# EAGLE schematic LCD (EAGLE 9.0.0)
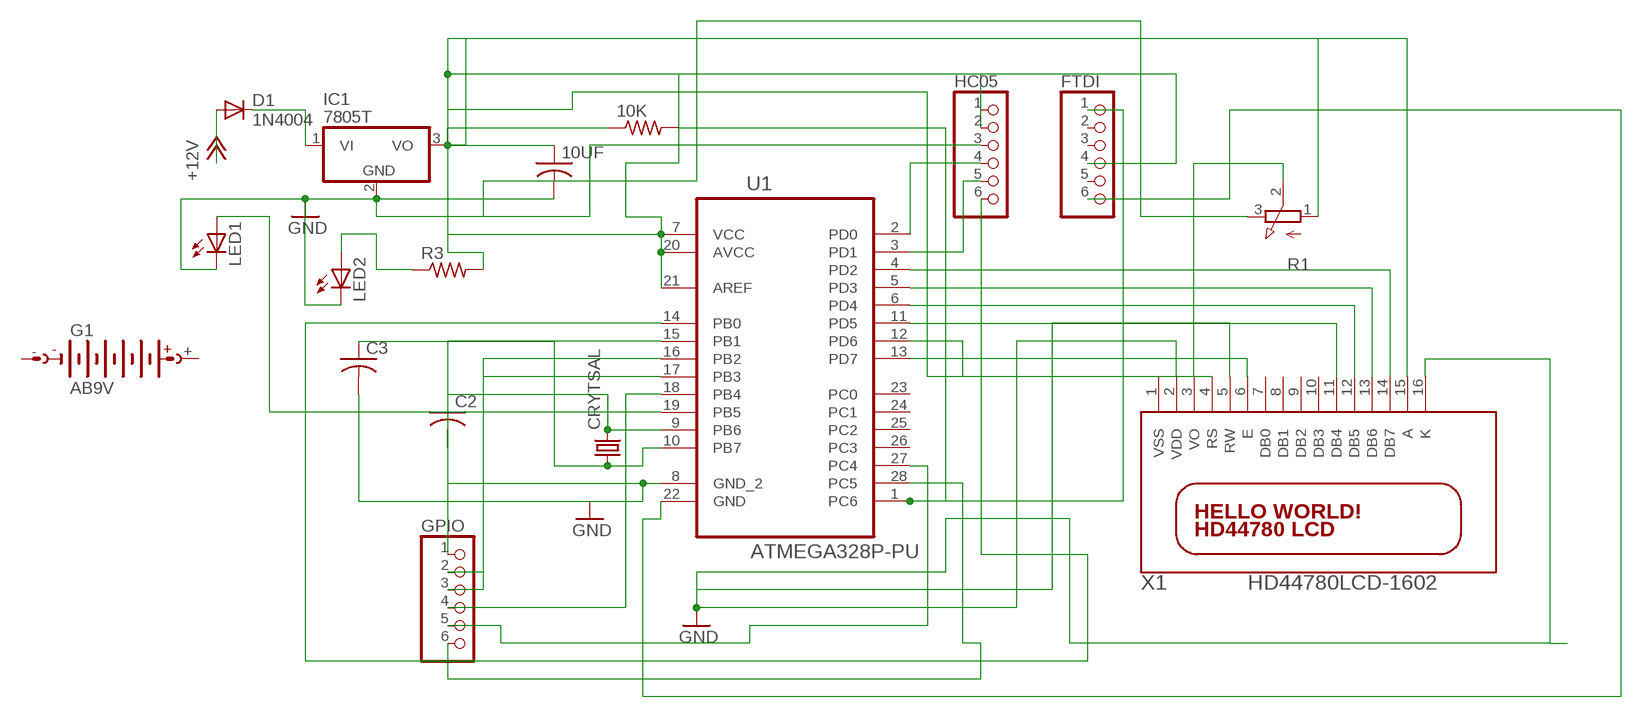
[diagram p0: schematic, sheet 1]

## Parts
10K  R-US_0204/5  [0204/5]
10UF  C-US050-025X075  [C050-025X075]
C2  C-US025-024X044  [C025-024X044]
C3  C-US025-024X044  [C025-024X044]
CRYTSAL  CRYSTALHC49U-V  [HC49U-V]
D1  1N4004  [DO41-10]
FTDI  PINHD-1X6-3.5MM  [1X06-3.5MM]
G1  AB9V  [AB9V]
GPIO  PINHD-1X6-3.5MM  [1X06-3.5MM]
HC05  PINHD-1X6-3.5MM  [1X06-3.5MM]
IC1  7805T  [TO220H]
LED1  LED5MM  [LED5MM]
LED2  LED5MM  [LED5MM]
R1  3RP/1610N  [3RP/1610N]
R3  R-US_0204/5  [0204/5]
U1  ATMEGA328P-PU  [DIP254P762X457-28]
X1  HD44780LCD-1602  [LCD1602]

## Nets
+12V: D1.A
GND: 10UF.2 HC05.3 IC1.2(GND) LED1.K(C) LED2.K(C) R1.3(E)
N$1: R1.2(S) X1.3(VO)
N$2: 10K.1 10UF.1 FTDI.4 HC05.2 IC1.3(VO) R1.1(A) R3.2 U1.7(VCC) U1.20(AVCC) U1.21(AREF) X1.15(A)
N$3: GPIO.1 U1.15(PB1)
N$4: 10K.2 FTDI.1 U1.1(PC6)
N$5: C2.1 CRYTSAL.2 U1.9(PB6)
N$6: C3.1 CRYTSAL.1 U1.10(PB7)
N$7: C2.2 C3.2 U1.8(GND_2)
N$8: U1.4(PD2) X1.14(DB7)
N$9: U1.5(PD3) X1.13(DB6)
N$10: U1.6(PD4) X1.12(DB5)
N$11: U1.12(PD6) X1.4(RS)
N$12: U1.13(PD7) X1.6(E)
N$13: U1.11(PD5) X1.11(DB4)
N$14: GPIO.2 U1.16(PB2)
N$15: FTDI.6 U1.22(GND)
N$16: D1.C IC1.1(VI)
N$17: HC05.4 U1.2(PD0)
N$18: HC05.5 U1.3(PD1)
N$19: HC05.6 U1.14(PB0)
N$20: LED2.A R3.1
N$21: LED1.A U1.19(PB5)
N$22: GPIO.3 U1.17(PB3)
N$23: GPIO.4 U1.18(PB4)
N$24: GPIO.5 U1.27(PC4)
N$25: GPIO.6 U1.28(PC5)
VDD: X1.2(VDD) X1.5(RW) X1.16(K) ; supply symbol labelled GND
VSS: X1.1(VSS)
Unconnected: FTDI.2 FTDI.3 FTDI.5 G1.+ G1.- HC05.1 U1.23(PC0) U1.24(PC1) U1.25(PC2) U1.26(PC3) X1.7(DB0) X1.8(DB1) X1.9(DB2) X1.10(DB3)

## Library data of the parts
10K R3 = rcl:R-US_: RESISTOR, American symbol; SPICEPREFIX: R
10UF C2 C3 = adafruit:C-US: CAPACITOR, American symbol
CRYTSAL = adafruit:CRYSTAL: CRYSTAL; OC_FARNELL: 1666969; OC_NEWARK: unknown
D1 = diode:1N4004: DIODE general purpose rectifier, 1 A
FTDI GPIO HC05 = adafruit:PINHD-1X6: PIN HEADER
G1 = battery:AB9V: 9-V BATTERY CLIP
IC1 = adafruit:78*: Positive VOLTAGE REGULATOR Added bigger pads to the TO-92 package
LED1 LED2 = adafruit:LED: LED OSRAM: - CHIPLED LG R971, LG N971, LY N971, LG Q971, LY Q971, LO R971, LY R971 LH N974, LH R974 LS Q976, LO Q976, LY Q976 LO Q996 - Hyper CHIPLED LW Q18S LB Q993, LB Q99A, LB R99A - SideLED LS A670, LO A670, LY A670, LG A670, LP A670 LB A673, LV A673, LT A673, LW A673 LH A674 LY A675 LS A676, LA A676, LO A676, LY A676, LW A676 LS A679, LY A679, LG A679 - Hyper Micro SIDELED® LS Y876, LA Y876, LO Y876, LY Y876 LT Y87S - SmartLED LW L88C, LW L88S LB L89C, LB L89S, LG L890 LS L89K, LO L89K, LY L89K LS L896, LA L896, LO L896, LY L896 - TOPLED LS T670, LO T670, LY T670, LG T670, LP T670 LSG T670, LSP T670, LSY T670, LOP T670, LYG T670 LG T671, LOG T671, LSG T671 LB T673, LV T673, LT T673, LW T673 LH T674 LS T676, LA T676, LO T676, LY T676, LB T676, LH T676, LSB T676, LW T676 LB T67C, LV T67C, LT T67C, LS T67K, LO T67K, LY T67K, LW E67C LS E67B, LA E67B, LO E67B, LY E67B, LB E67C, LV E67C, LT E67C LW T67C LS T679, LY T679, LG T679 LS T770, LO T770, LY T770, LG T770, LP T770 LB T773, LV T773, LT T773, LW T773 LH T774 LS E675, LA E675, LY E675, LS T675 LS T776, LA T776, LO T776, LY T776, LB T776 LHGB T686 LT T68C, LB T68C - Hyper Mini TOPLED® LB M676 - Mini TOPLED Santana® LG M470 LS M47K, LO M47K, LY M47K Source: http://www.osram.convergy.de/
R1 = pot:3RP/1610N: 16mm Potentiometer one level Source: http://www.alphapotentiometers.net/html/16mm_pot_2.html
U1 = Atmel_By_element14_Batch_1-00:ATMEGA328P-PU: 8-bit Microcontroller with In-System Programmable Flash; MPN: ATMEGA328P-PU; OC_FARNELL: 1715487; OC_NEWARK: 15R0268; PACKAGE: PDIP-28; SUPPLIER: Atmel
X1 = adafruit:HD44780LCD: HD44780 LCD Standard character type LCDs, available in sizes from 8x1 to 40x4!